# EasyEDA Pro project RV1106_V1.epro, board PCB1
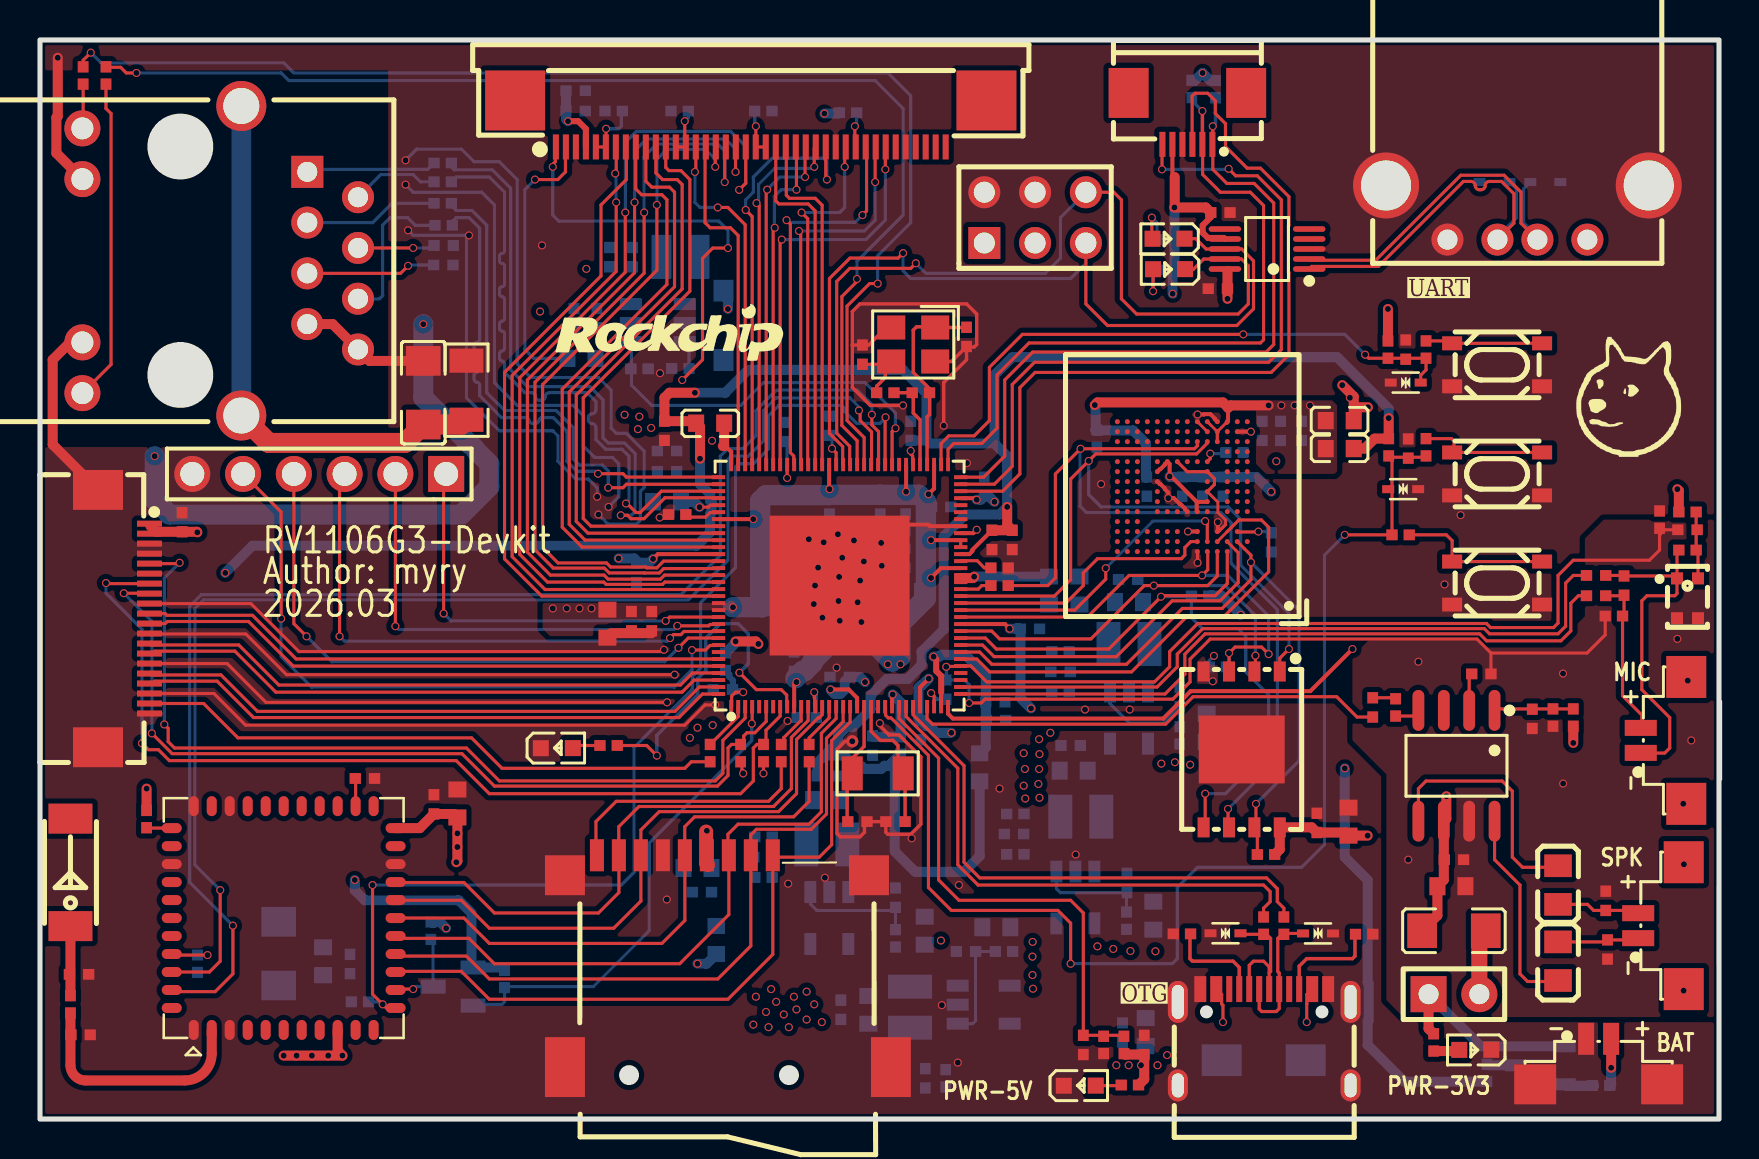
[diagram p13: board, top side]
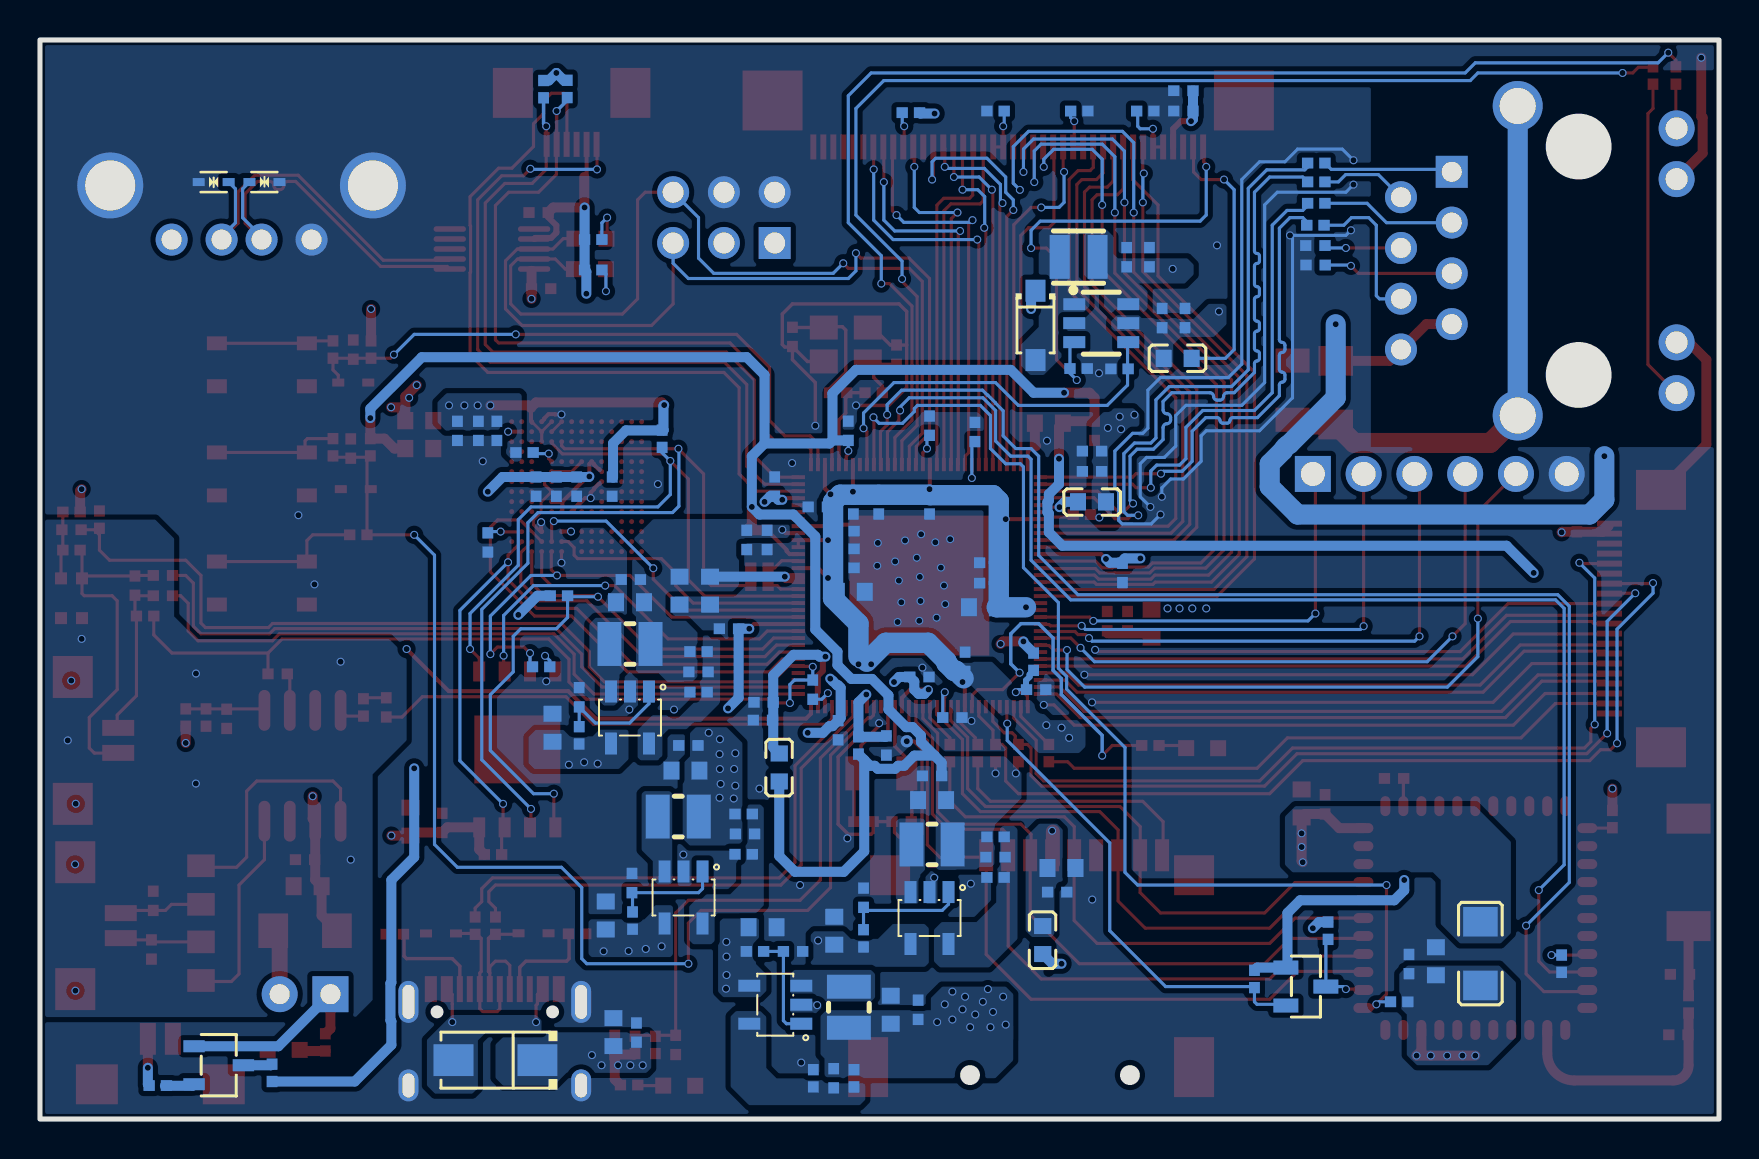
[diagram p14: board, bottom side, seen from below]

Outline 84 x 54 mm; copper layers: Top Layer, GND, PWR, Bottom Layer. Coordinates in mm from the lower left corner of the outline.
Outline path: rectangle 0,54 84,0
Stack: Top Layer 0.035mm Outer layer thickness 1oz / Dielectric1 0.2104mm 7628 RC49% 8.6mil / GND 0.0152mm Inner layer thickness / Dielectric2 1.065mm 1.1mm H/HOZ Copper / PWR 0.0152mm Inner layer thickness / Dielectric3 0.2104mm 7628 RC49% 8.6mil / Bottom Layer 0.035mm Outer layer thickness 1oz

## Design rules (mm)
net UART_DP: DP10
net UART_DN: DP10
net $8N37: DP1
net $8N38: DP1
net MIPI_RX_D1N: DP7
net MIPI_RX_D1P: DP7
net MIPI_RX_CLK0N: DP8
net MIPI_RX_CLK0P: DP8
net MIPI_RX_D0N: DP9
net MIPI_RX_D0P: DP9
net ETH_RN: DP3
net ETH_RP: DP3
net ETH_TN: DP4
net ETH_TP: DP4
net USB_DN: DP2
net USB_DP: DP2
spacing copperThickness1oz (default): track to track 0.102, other pairs 0.152 to 0.3
spacing copperThickness2oz: track to track 0.203, other pairs 0.152 to 0.3
track width copperThickness1oz (default): min 0.127, default 0.5, max 2.54
track width copperThickness2oz: min 0.203, default 0.254, max 2.54
differential pair differentialPair (default): width min 0.127, default 0.158, max 2.54; gap min 0.152, default 0.2
net 0V9 uses copperRegion
net $1N52 uses copperRegion
net +5V uses copperRegion
net GND uses copperRegion
net $1N43 uses copperRegion
net 3V3 uses copperRegion
net $1N38 uses copperRegion
net 1V8 uses copperRegion
net $1N4 uses copperRegion
net AGND uses copperRegion
net VCC_FLASH uses copperRegion
net $10N1 uses copperRegion
net $11N32 uses copperRegion
net $13N14 uses copperRegion
net $8N5 uses copperRegion
net $11N45 uses copperRegion
net $1N53 uses copperRegion
net $1N44 uses copperRegion
net $1N39 uses copperRegion
net $1N5 uses copperRegion
net EMMC_D6 uses copperRegion

## Placement (name value [footprint] x y rotation side)
C1  22pF DNP  [C0402]  48.73 14.27 0 bottom
C2  10uF  [C0603]  55.63 10.18 90 bottom
C3  22uF  [C0603]  51.71 17.51 0 bottom
C4  100nF  [C0402]  51.56 18.69 180 bottom
C6  22pF DNP  [C0402]  51.05 22.38 0 bottom
C7  10uF  [C0603]  58.29 19.58 90 bottom
C8  22uF  [C0603]  54.48 25.93 0 bottom
C9  100nF  [C0402]  54.44 27 180 bottom
C10  100nF  [C0402]  57.02 21.11 270 bottom
C11  22pF DNP  [C0402]  44.29 2.04 90 bottom
C12  10uF  [C0603]  47.85 9.53 180 bottom
C13  22uF  [C0603]  41.37 5.47 90 bottom
C14  22pF DNP  [C0402]  36.2 13.11 0 bottom
C15  100nF  [C0402]  40.07 5.47 270 bottom
C16  10uF  [C0603]  44.2 9.42 90 bottom
C17  22uF  [C0603]  39.37 16.03 0 bottom
C18  100nF  [C0402]  39.37 17.17 180 bottom
C19  100nF  [C0402]  46.33 8.39 0 bottom
C20  100nF  [C0402]  42.8 11.07 270 bottom
C21  1uF  [C0402]  77.85 27.2 180 top
C22  1uF  [C0402]  77.85 26.19 180 top
C23  4.7uF  [C0402]  47.8 20.85 0 bottom
C24  100nF  [C0402]  47.83 19.96 0 bottom
C25  4.7uF  [C0402]  45.34 21.49 270 bottom
C26  1uF  [C0402]  31.37 33.43 0 bottom
C27  100nF  [C0402]  31.37 32.41 0 bottom
C28  100nF  [C0402]  41.66 18.69 270 bottom
C29  100nF  [C0402]  44.07 19.46 270 bottom
C30  10uF  [C0603]  36.83 25.68 0 bottom
C31  10uF  [C0603]  43.43 26.31 180 bottom
C32  1uF  [C0402]  36.51 26.82 0 bottom
C33  1uF  [C0402]  43.75 27.58 180 bottom
C34  100nF  [C0402]  43.75 29.42 180 bottom
C35  100nF  [C0402]  43.75 28.54 180 bottom
C36  100nF  [C0402]  36.51 27.84 0 bottom
C37  100nF  [C0402]  39.5 30.76 270 bottom
C38  100nF  [C0402]  37.72 22.88 90 bottom
C39  100nF  [C0402]  42.04 30.76 270 bottom
C40  100nF  [C0402]  43.31 30.76 270 bottom
C41  10uF  [C0603]  28.32 24.79 270 top
C42  1uF  [C0402]  29.59 24.92 270 top
C43  100nF  [C0402]  30.61 24.92 270 top
C44  10uF  [C0603]  52.07 26.44 270 bottom
C45  10uF  [C0603]  50.55 26.44 270 bottom
C46  1uF  [C0402]  47.62 28.98 270 bottom
C47  100nF  [C0402]  48.64 28.98 270 bottom
C48  1uF  [C0402]  47.62 28.98 270 top
C49  100nF  [C0402]  48.64 28.98 270 top
C50  22pF  [C0402]  41.15 38.25 90 top
C51  100nF  [C0402]  43.56 34.44 90 bottom
C52  22pF  [C0402]  46.36 39.14 270 top
C53  NC  [C0402]  40.89 14.88 0 top
C54  100nF  [C0402]  31.24 34.44 270 top
C55  NC  [C0402]  42.8 14.88 180 top
C56  1uF  [C0402]  40.01 22.12 180 bottom
C57  100nF  [C0402]  45.08 30.63 0 bottom
C58  100nF  [C0402]  47.24 31.65 90 bottom
C59  100nF  [C0402]  39.5 34.7 90 bottom
C60  100nF  [C0402]  49.53 24.54 0 bottom
C61  100nF  [C0402]  38.35 20.09 180 bottom
C62  100nF  [C0402]  29.84 27.33 270 bottom
C63  100nF  [C0402]  37.23 34.38 90 bottom
C64  100nF  [C0402]  34.16 21.49 180 bottom
C65  100nF  [C0402]  82.42 29.49 180 top
C66  10pF DNP  [C0402]  79.25 26.69 270 top
C67  100nF  [C0402]  74.66 20.03 270 top
C68  1nF  [C0402]  78.42 8.48 90 top
C69  1uF  [C0402]  72.11 22.28 180 top
C70  47nF  [C0402]  66.67 20.6 90 top
C71  100nF  [C0402]  70.74 12.98 180 top
C73  1nF  [C0402]  78.33 10.92 270 top
C74  10nF  [C0402]  20.18 42.74 0 bottom
C75  100nF  [C0402]  68.33 38.51 90 top
C76  10nF  [C0402]  20.19 43.71 0 bottom
C77  100nF  [C0402]  68.45 33.55 90 top
C78  100nF  [C0402]  58.93 41.55 180 top
C79  4.7uF  [C0402]  59.05 45.36 0 top
C80  2.2uF  [C0402]  55.24 3.71 90 top
C81  22uF  [C0603]  55.24 4.35 90 bottom
C82  100nF  [C0402]  54.16 4.33 90 bottom
C83  100nF  [C0402]  52.2 3.71 270 top
C84  100nF  [C0402]  63.88 14.82 90 top
C85  10uF  [C0603]  65.53 14.88 90 top
C86  4.7uF  [C0402]  63.12 34.44 270 bottom
C87  100nF  [C0402]  62.07 34.44 270 bottom
C88  100nF  [C0402]  61.14 34.44 270 bottom
C89  100nF  [C0402]  55.37 31.65 270 bottom
C91  4.7uF  [C0402]  59.18 31.65 270 bottom
C92  100nF  [C0402]  58.17 31.65 270 bottom
C93  100nF  [C0402]  57.15 31.65 270 bottom
C94  100nF  [C0402]  33.11 11.35 180 bottom
C95  10uF  [C0603]  32.89 12.49 180 bottom
C96  4.7uF  [C0402]  29.64 43.13 90 bottom
C97  100nF  [C0402]  28.49 43.13 90 bottom
C98  1uF  [C0402]  27.86 40.08 90 bottom
C99  100nF  [C0402]  26.71 40.08 90 bottom
C100  4.7uF  [C0402]  26.8 50.44 0 bottom
C101  100nF  [C0402]  26.8 51.46 0 bottom
C102  100nF  [C0402]  7.11 29.87 90 top
C103  NC  [C0402]  2.03 4.22 0 top
C104  NC  [C0402]  1.95 7.24 0 top
C105  10uF  [C0603]  14.1 7.9 90 bottom
C106  100nF  [C0402]  15.51 7.75 90 bottom
C107  10uF  [C0603]  20.95 15.79 90 top
C108  100nF  [C0402]  19.71 15.75 90 top
C109  100nF DNP  [C0402]  16.26 17.04 0 top
C110  1uF  [C0402]  61.59 28.85 90 bottom
C111  22uF  [C0603]  70.61 11.58 0 top
C112  NC  [C0402]  54.38 11.81 270 bottom
C113  1nF  [C1206]  19.18 36.35 90 top
CARD1  TF-01A  [TF-SMD_TF-02]  34.42 7.9 0 top
D1  BAT54C  [SOT-23-3_L2.9-W1.6-P1.90-LS2.8-BR]  75.06 2.69 0 bottom
D2  LESD5Z5.0CT1G  [SOD-523_L1.2-W0.8-LS1.6-BI]  68.33 36.85 0 top
D3  LESD5Z5.0CT1G  [SOD-523_L1.2-W0.8-LS1.6-BI]  68.2 31.52 180 top
D4  LESD5Z5.0CT1G  [SOD-523_L1.2-W0.8-LS1.6-BI]  75.31 46.89 180 bottom
D5  LESD5Z5.0CT1G  [SOD-523_L1.2-W0.8-LS1.6-BI]  72.77 46.89 0 bottom
D6  SS34  [SMA_L4.3-W2.5-LS5.0-RD]  61.21 2.95 0 bottom
D7  LESD5Z5.0CT1G  [SOD-523_L1.2-W0.8-LS1.6-BI]  63.94 9.29 180 top
D8  LESD5Z5.0CT1G  [SOD-523_L1.2-W0.8-LS1.6-BI]  59.31 9.3 0 top
D16  B5819W  [SOD-123F_L2.7-W1.6-LS3.8-RD-1]  34.2 39.72 270 bottom
FPC1  0.5K-AS-40PWBG  [FPC-SMD_40P-P0.50_0.5K-AS-40PWB]  35.56 49.81 180 top
FPC2  FPC-05F-6PH20  [FPC-SMD_6P-P0.50_XUNPU_FPC-05F-6PH20]  57.4 50.06 180 top
FPC3  FPC-05F-20PH20  [FPC-SMD_20P-P0.50_XUNPU_FPC-05F-20PH20]  4.19 25.04 270 top
H1  -  [HDR-TH_2P-P2.54-V-M-1]  70.74 6.25 0 top
H3  -  [HDR-TH_6P-P2.54-V-M-1]  13.97 32.28 180 top
H4  -  [HDR-TH_6P-P2.54-V-R2-C3-S2.54_A2541WV-2X3P]  49.78 45.11 0 top
J1  HR911105A  [RJ45-TH_HR911105A]  9.02 42.95 270 top
L1  2.2uH  [IND-SMD_L2.5-W2.0-1]  52.07 15.14 0 bottom
L2  120R@100MHZ  [L0603]  47.02 17.59 90 bottom
L3  2.2uH  [IND-SMD_L2.5-W2.0-1]  54.48 23.77 0 bottom
L4  2.2uH  [IND-SMD_L2.5-W2.0-1]  43.53 5.59 90 bottom
L5  2.2uH  [IND-SMD_L2.5-W2.0-1]  39.37 13.74 0 bottom
L6  120R@100MHZ  [L0603]  31.37 30.89 0 bottom
L7  120R@100MHZ  [L0603]  33.53 34.82 180 top
L8  120R  [L0603]  65.02 34.95 0 top
L9  120R  [L0603]  65.02 33.55 0 top
L10  600R  [L1206]  70.74 9.42 180 top
L11  1K 0.5A  [L0805]  75.95 7.9 90 top
L12  1K 0.5A  [L0805]  75.95 11.71 270 top
L13  120R  [L0603]  33.83 8.96 90 bottom
L14  120R @ 100MHZ  [L0603]  27.08 38.06 180 bottom
L15  22uH  [IND-SMD_L2.5-W2.0_SWPA252012S]  32.04 43.14 0 bottom
L16  AN2051-245  [ANT2051]  1.52 12.34 90 top
L17  600R  [L1206]  11.94 8.28 270 bottom
LED1  -  [LED_0603]  71.76 3.45 180 top
LED2  -  [LED_0603]  25.91 18.57 0 top
LED3  -  [LED_0603]  56.44 42.52 180 top
LED4  -  [LED_0603]  56.41 44.05 180 top
LED5  -  [LED_0603]  52.07 1.68 0 top
MIC1  ZTS6216  [MIC-SMD_4P-L2.8-W1.9-P1.84-TL]  82.42 26.06 0 top
Q1  2SK3018  [SOT-23-3_L2.9-W1.3-P1.90-LS2.4-BR]  20.67 6.63 0 bottom
R1  10kΩ  [R0402_3]  54.36 9.93 90 bottom
R2  100kΩ  [R0402_3]  48.8 15.26 180 bottom
R3  200kΩ  [R0402_3]  48.8 13.25 0 bottom
R4  1Ω  [R0402_3]  43.05 18.69 90 bottom
R5  100kΩ  [R0402_3]  57.02 19.2 90 bottom
R6  240kΩ  [R0402_3]  51.05 23.39 180 bottom
R7  1Ω  [R0402_3]  34.29 22.88 270 bottom
R8  191kΩ  [R0402_3]  51.05 21.36 0 bottom
R9  200kΩ  [R0402_3]  48.23 8.39 0 bottom
R10  680kΩ  [R0402_3]  43.28 2.04 90 bottom
R11  2kΩ  [R0402_3]  69.72 3.83 90 top
R12  100kΩ  [R0402_3]  42.8 9.04 270 bottom
R13  200kΩ  [R0402_3]  36.2 14.12 0 bottom
R14  150kΩ  [R0402_3]  45.31 2.04 270 bottom
R15  100kΩ  [R0402_3]  36.2 12.09 180 bottom
R16  1kΩ  [R0402_3]  78.11 1.68 0 bottom
R17  100Ω  [R0402_3]  72.39 2.31 90 bottom
R18  0Ω  [R0402_3]  81.03 30 90 top
R19  240Ω  [R0402_3]  48.01 27.58 0 top
R20  6.04kΩ  [R0402_3]  31.88 30.25 180 top
R21  22Ω  [R0402_3]  42.29 36.35 0 top
R22  1MΩ  [R0402_3]  44.07 36.35 0 top
R23  22Ω  [R0402_3]  48.01 26.69 0 top
R24  100Ω  [R0402_3]  37.08 18.31 270 top
R25  22Ω  [R0402_3]  38.48 18.31 270 top
R26  22Ω  [R0402_3]  33.53 18.31 270 top
R27  1kΩ  [R0402_3]  28.45 18.69 180 top
R28  100Ω  [R0402_3]  82.42 30.38 0 top
R29  1kΩ  [R0402_3]  82.42 28.47 0 top
R30  1kΩ  [R0402_3]  78.74 25.17 0 top
R31  20kΩ  [R0402_3]  76.71 20.09 270 top
R32  10kΩ  [R0402_3]  75.69 20.09 90 top
R33  30kΩ  [R0402_3]  67.82 20.6 90 top
R34  10kΩ  [R0402_3]  67.44 38.51 270 top
R35  100Ω  [R0402_3]  69.34 38.51 90 top
R36  0Ω  [R0402_3]  20.19 44.73 0 bottom
R37  0Ω  [R0402_3]  20.15 45.83 0 bottom
R38  0Ω  [R0402_3]  20.15 46.9 0 bottom
R39  0Ω  [R0402_3]  20.15 47.84 0 bottom
R40  1kΩ  [R0402_3]  2.16 52.22 90 top
R41  1kΩ  [R0402_3]  3.3 52.22 90 top
R42  10kΩ  [R0402_3]  67.47 33.62 270 top
R43  5.1kΩ  [R0402_3]  68.07 29.23 0 top
R44  100Ω  [R0402_3]  69.34 33.62 90 top
R45  4.7kΩ  [R0402_3]  56.32 42.49 180 bottom
R46  4.7kΩ  [R0402_3]  56.32 44.01 180 bottom
R47  10kΩ  [R0402_3]  54.23 3.71 270 top
R48  2.2Ω  [R0402_3]  61.21 9.68 90 top
R49  2.2Ω  [R0402_3]  62.23 9.68 270 top
R50  15kΩ  [R0402_3]  53.21 3.71 90 top
R51  5.1kΩ  [R0402_3]  57.13 9.27 0 top
R52  2kΩ  [R0402_3]  54.53 1.7 0 top
R53  5.1kΩ  [R0402_3]  66.25 9.25 180 top
R54  10kΩ  [R0402_3]  58.93 22.63 0 bottom
R55  10kΩ  [R0402_3]  61.34 13.24 180 top
R56  4.7kΩ  [R0402_3]  59.76 33.36 0 bottom
R57  10kΩ  [R0402_3]  58.04 26.19 0 bottom
R58  10kΩ  [R0402_3]  52.87 34.04 90 bottom
R59  0Ω  [R0402_3]  28.7 50.44 0 bottom
R60  0Ω  [R0402_3]  32 50.44 0 bottom
R61  0Ω  [R0402_3]  36.2 50.44 180 bottom
R62  100kΩ  [R0402_3]  29.99 37.54 0 bottom
R63  5.1Ω  [R0402_3]  32.04 37.56 180 bottom
R64  10kΩ  [R0402_3]  40.43 50.36 0 bottom
R65  4.7kΩ  [R0402_3]  35.05 18.31 270 top
R66  4.7kΩ  [R0402_3]  36.2 18.31 270 top
R67  0Ω  [R0402_3]  1.52 5.74 270 top
R68  47kΩ  [R0402_3]  16 5.87 180 bottom
R69  10kΩ DNP  [R0402_3]  7.87 7.77 90 bottom
R70  47kΩ  [R0402_3]  5.33 15.01 270 top
R71  10kΩ  [R0402_3]  23.24 7.01 270 bottom
R72  10kΩ  [R0402_3]  19.56 9.42 270 bottom
R73  10kΩ  [R0402_3]  57.62 51.55 270 bottom
R74  10kΩ  [R0402_3]  58.81 51.54 270 bottom
R75  1M  [R1206]  21.34 36.47 90 top
SW1  TS3425BA  [SW-SMD_4P-L4.2-W3.2-P2.15-LS4.6-1]  72.9 37.74 0 top
SW2  TS3425BA  [SW-SMD_4P-L4.2-W3.2-P2.15-LS4.6-1]  72.9 32.28 0 top
SW3  TS3425BA  [SW-SMD_4P-L4.2-W3.2-P2.15-LS4.6-1]  72.9 26.82 0 top
U1  -  [QFN-128_L12.3-W12.3-P0.35-TL-EP7.0-1]  40.01 26.69 90 top
U2  MT3520B  [SOT-23-5_L3.0-W1.7-P0.95-LS2.8-BR]  51.8 11.09 90 bottom
U3  MT3520B  [SOT-23-5_L3.0-W1.7-P0.95-LS2.8-BR]  54.48 20.09 90 bottom
U4  MT3520B  [SOT-23-5_L3.0-W1.7-P0.95-LS2.8-BR]  47.21 5.72 180 bottom
U5  MT3520B  [SOT-23-5_L3.0-W1.7-P0.95-LS2.8-BR]  39.5 10.06 90 bottom
U6  ZX-MX1.25-2PLT  [CONN-SMD_2P-P1.25-MX1.25-2P-LT]  77.98 2.56 0 top
U7  ZX-MX1.25-2PLT  [CONN-SMD_2P-P1.25-MX1.25-2P-LT]  81.53 18.95 90 top
U8  NS4158  [SOIC-8_L4.9-W3.9-P1.27-LS6.0-BL]  70.87 17.68 180 top
U9  ZX-MX1.25-2PLT  [CONN-SMD_2P-P1.25-MX1.25-2P-LT]  81.41 9.68 90 top
U10  CH340E  [MSOP-10_L3.0-W3.0-P0.50-LS5.0-BL]  61.39 43.54 90 top
U11  W25N02KVZEIR  [WSON-8_L8.0-W6.0-P1.27-TL-EP-1]  60.12 18.5 270 top
U12  -  [FBGA-153_L13.0-W11.5-P0.50_KLMAG1JETD-B041]  57.15 31.65 180 top
U13  MT9284-28J  [SOT-23-6_L2.9-W1.6-P0.95-LS2.8-BR]  30.91 39.83 0 bottom
U14  -  [RTL8723DS]  12.19 10.06 90 top
USB2  HC-TYPE-C-16P-01A  [USB-C-SMD_HC-TYPE-C-16P-01A]  61.25 4.09 0 top
USB3  USB-231-ARY  [USB-A-TH_USB-231-ARY]  73.91 45.36 180 top
X1  24MHz  [CRYSTAL-SMD_4P-L3.2-W2.5-BL]  43.69 38.76 180 top
X2  32.768kHz  [OSC-SMD_L3.2-W1.5]  41.91 17.3 180 top

## Footprints (pads in the part's own frame, mm; a bottom-side part is the same pattern mirrored in y, then rotated)
ANT2051
  rect 1.5x2.2 smd: 1(-2.69,0) 2(2.69,0)
C0402
  rect 0.566x0.54 smd: 1(-0.481,0) 2(0.481,0)
C0603
  rect 0.8x0.9 smd: 1(-0.701,0.068) 2(0.699,0.068)
C1206
  rect 1.485x1.728 smd: 1(-1.593,0) 2(1.593,0)
CONN-SMD_2P-P1.25-MX1.25-2P-LT
  rect 0.8x1.6 smd: 1(-0.625,1.45) 2(0.625,1.45)
  rect 2.1x2 smd: 3(-3.175,-0.827) 4(3.175,-0.827)
CRYSTAL-SMD_4P-L3.2-W2.5-BL
  rect 1.4x1.2 smd: 1(-1.1,-0.85) 2(1.1,-0.85) 3(1.1,0.85) 4(-1.1,0.85)
FBGA-153_L13.0-W11.5-P0.50_KLMAG1JETD-B041
  round 0.25 smd: A3(-2.25,3.25) A4(-1.75,3.25) A5(-1.25,3.25) A6(-0.75,3.25) A8(0.25,3.25) A9(0.75,3.25) A10(1.25,3.25) A11(1.75,3.25) A12(2.25,3.25) A13(2.75,3.25) A14(3.25,3.25) B1(-3.25,2.75) B2(-2.75,2.75) B3(-2.25,2.75) B4(-1.75,2.75) B5(-1.25,2.75) B6(-0.75,2.75) B8(0.25,2.75) B9(0.75,2.75) B10(1.25,2.75) B11(1.75,2.75) B12(2.25,2.75) B13(2.75,2.75) B14(3.25,2.75) C2(-2.75,2.25) C4(-1.75,2.25) C6(-0.75,2.25) C8(0.25,2.25) C9(0.75,2.25) C10(1.25,2.25) C11(1.75,2.25) C12(2.25,2.25) C13(2.75,2.25) C14(3.25,2.25) D12(2.25,1.75) D13(2.75,1.75) D14(3.25,1.75) E1(-3.25,1.25) E2(-2.75,1.25) E3(-2.25,1.25) E5(-1.25,1.25) E6(-0.75,1.25) E7(-0.25,1.25) E8(0.25,1.25) E9(0.75,1.25) E10(1.25,1.25) E12(2.25,1.25) E13(2.75,1.25) E14(3.25,1.25) F1(-3.25,0.75) F2(-2.75,0.75) F3(-2.25,0.75) F5(-1.25,0.75) F10(1.25,0.75) F12(2.25,0.75) F13(2.75,0.75) F14(3.25,0.75) G1(-3.25,0.25) G2(-2.75,0.25) G3(-2.25,0.25) G5(-1.25,0.25) G10(1.25,0.25) G12(2.25,0.25) G13(2.75,0.25) G14(3.25,0.25) H1(-3.25,-0.25) H2(-2.75,-0.25) H3(-2.25,-0.25) H5(-1.25,-0.25) H10(1.25,-0.25) H12(2.25,-0.25) H13(2.75,-0.25) H14(3.25,-0.25) J1(-3.25,-0.75) J2(-2.75,-0.75) J3(-2.25,-0.75) J5(-1.25,-0.75) J10(1.25,-0.75) J12(2.25,-0.75) J13(2.75,-0.75) J14(3.25,-0.75) K1(-3.25,-1.25) K2(-2.75,-1.25) K3(-2.25,-1.25) K5(-1.25,-1.25) K6(-0.75,-1.25) K7(-0.25,-1.25) K8(0.25,-1.25) K9(0.75,-1.25) K10(1.25,-1.25) K12(2.25,-1.25) K13(2.75,-1.25) K14(3.25,-1.25) L1(-3.25,-1.75) L2(-2.75,-1.75) L3(-2.25,-1.75) M1(-3.25,-2.25) M2(-2.75,-2.25) M3(-2.25,-2.25) M4(-1.75,-2.25) M5(-1.25,-2.25) M6(-0.75,-2.25) M7(-0.25,-2.25) M8(0.25,-2.25) M9(0.75,-2.25) M10(1.25,-2.25) M11(1.75,-2.25) M12(2.25,-2.25) M13(2.75,-2.25) M14(3.25,-2.25) N2(-2.75,-2.75) N3(-2.25,-2.75) N4(-1.75,-2.75) N5(-1.25,-2.75) N6(-0.75,-2.75) N7(-0.25,-2.75) N8(0.25,-2.75) N9(0.75,-2.75) N10(1.25,-2.75) N11(1.75,-2.75) N12(2.25,-2.75) N13(2.75,-2.75) N14(3.25,-2.75) P1(-3.25,-3.25) P2(-2.75,-3.25) P3(-2.25,-3.25) P4(-1.75,-3.25) P5(-1.25,-3.25) P6(-0.75,-3.25) P7(-0.25,-3.25) P8(0.25,-3.25) P9(0.75,-3.25) P10(1.25,-3.25) P11(1.75,-3.25) P12(2.25,-3.25) P13(2.75,-3.25) P14(3.25,-3.25)
FPC-SMD_6P-P0.50_XUNPU_FPC-05F-6PH20
  rect 0.3x1.25 smd: 1(-1.25,1.288) 2(-0.75,1.288) 3(-0.25,1.288) 4(0.25,1.288) 5(0.75,1.288) 6(1.25,1.288)
  rect 2x2.5 smd: 7(2.94,-1.288) 8(-2.94,-1.288)
FPC-SMD_20P-P0.50_XUNPU_FPC-05F-20PH20
  rect 0.3x1.25 smd: 1(-4.75,1.288) 2(-4.25,1.288) 3(-3.75,1.288) 4(-3.25,1.288) 5(-2.75,1.288) 6(-2.25,1.288) 7(-1.75,1.288) 8(-1.25,1.288) 9(-0.75,1.288) 10(-0.25,1.288) 11(0.25,1.288) 12(0.75,1.288) 13(1.25,1.288) 14(1.75,1.288) 15(2.25,1.288) 16(2.75,1.288) 17(3.25,1.288) 18(3.75,1.288) 19(4.25,1.288) 20(4.75,1.288)
  rect 2x2.5 smd: 21(6.44,-1.288) 22(-6.44,-1.288)
FPC-SMD_40P-P0.50_0.5K-AS-40PWB
  rect 0.3x1.25 smd: 1(9.75,1.163) 2(9.25,1.163) 3(8.75,1.163) 4(8.25,1.163) 5(7.75,1.163) 6(7.25,1.163) 7(6.75,1.163) 8(6.25,1.163) 9(5.75,1.163) 10(5.25,1.163) 11(4.75,1.163) 12(4.25,1.163) 13(3.75,1.163) 14(3.25,1.163) 15(2.75,1.163) 16(2.25,1.163) 17(1.75,1.163) 18(1.25,1.163) 19(0.75,1.163) 20(0.25,1.163) 21(-0.25,1.163) 22(-0.75,1.163) 23(-1.25,1.163) 24(-1.75,1.163) 25(-2.25,1.163) 26(-2.75,1.163) 27(-3.25,1.163) 28(-3.75,1.163) 29(-4.25,1.163) 30(-4.75,1.163) 31(-5.25,1.163) 32(-5.75,1.163) 33(-6.25,1.163) 34(-6.75,1.163) 35(-7.25,1.163) 36(-7.75,1.163) 37(-8.25,1.163) 38(-8.75,1.163) 39(-9.25,1.163) 40(-9.75,1.163)
  rect 3x3 smd: 41(-11.79,-1.163) 42(11.79,-1.163)
HDR-TH_2P-P2.54-V-M-1
  rect 1.8x1.8 hole 1: 1(-1.27,0)
  round 1.8 hole 1: 2(1.27,0)
HDR-TH_6P-P2.54-V-M-1
  rect 1.8x1.8 hole 1.2: 1(-6.35,0)
  round 1.8 hole 1.2: 2(-3.81,0) 3(-1.27,0) 4(1.27,0) 5(3.81,0) 6(6.35,0)
HDR-TH_6P-P2.54-V-R2-C3-S2.54_A2541WV-2X3P
  rect 1.6x1.6 hole 1.05: 1(-2.54,-1.27)
  round 1.6 hole 1.05: 2(-2.54,1.27) 3(0,-1.27) 4(0,1.27) 5(2.54,-1.27) 6(2.54,1.27)
IND-SMD_L2.5-W2.0-1
  rect 1.2x2.2 smd: 1(1.028,0) 2(-1.028,0)
IND-SMD_L2.5-W2.0_SWPA252012S
  rect 1x2.2 smd: 1(-0.951,0) 2(0.951,0)
L0603
  rect 0.8x0.864 smd: 1(-0.7,0) 2(0.7,0)
L0805
  rect 1.133x1.377 smd: 1(-0.966,0) 2(0.966,0)
L1206
  rect 1.485x1.728 smd: 1(-1.593,0) 2(1.593,0)
LED_0603
  rect 0.8x0.8 smd: 1(-0.851,-0.01) 2(0.75,-0.005)
MIC-SMD_4P-L2.8-W1.9-P1.84-TL
  rect 0.6x0.6 smd: 1(-0.525,0.995) 2(-0.525,-0.995) 3(0.525,-0.995) 4(0.525,0.995)
MSOP-10_L3.0-W3.0-P0.50-LS5.0-BL
  oval 0.28x1.62 smd: 1(-1,-2.11) 2(-0.5,-2.11) 3(0,-2.11) 4(0.5,-2.11) 5(1,-2.11) 6(1,2.11) 7(0.5,2.11) 8(0,2.11) 9(-0.5,2.11) 10(-1,2.11)
OSC-SMD_L3.2-W1.5
  rect 1.05x1.7 smd: 1(-1.275,0) 2(1.275,0)
QFN-128_L12.3-W12.3-P0.35-TL-EP7.0-1
  rect 0.665x0.196 smd: 1(-6.058,5.425) 2(-6.058,5.075) 3(-6.058,4.725) 4(-6.058,4.375) 5(-6.058,4.025) 6(-6.058,3.675) 7(-6.058,3.325) 8(-6.058,2.975) 9(-6.058,2.625) 10(-6.058,2.275) 11(-6.058,1.925) 12(-6.058,1.575) 13(-6.058,1.225) 14(-6.058,0.875) 15(-6.058,0.525) 16(-6.058,0.175) 17(-6.058,-0.175) 18(-6.058,-0.525) 19(-6.058,-0.875) 20(-6.058,-1.225) 21(-6.058,-1.575) 22(-6.058,-1.925) 23(-6.058,-2.275) 24(-6.058,-2.625) 25(-6.058,-2.975) 26(-6.058,-3.325) 27(-6.058,-3.675) 28(-6.058,-4.025) 29(-6.058,-4.375) 30(-6.058,-4.725) 31(-6.058,-5.075) 32(-6.058,-5.425) 65(6.058,-5.425) 66(6.058,-5.075) 67(6.058,-4.725) 68(6.058,-4.375) 69(6.058,-4.025) 70(6.058,-3.675) 71(6.058,-3.325) 72(6.058,-2.975) 73(6.058,-2.625) 74(6.058,-2.275) 75(6.058,-1.925) 76(6.058,-1.575) 77(6.058,-1.225) 78(6.058,-0.875) 79(6.058,-0.525) 80(6.058,-0.175) 81(6.058,0.175) 82(6.058,0.525) 83(6.058,0.875) 84(6.058,1.225) 85(6.058,1.575) 86(6.058,1.925) 87(6.058,2.275) 88(6.058,2.625) 89(6.058,2.975) 90(6.058,3.325) 91(6.058,3.675) 92(6.058,4.025) 93(6.058,4.375) 94(6.058,4.725) 95(6.058,5.075) 96(6.058,5.425)
  rect 0.196x0.665 smd: 33(-5.425,-6.058) 34(-5.075,-6.058) 35(-4.725,-6.058) 36(-4.375,-6.058) 37(-4.025,-6.058) 38(-3.675,-6.058) 39(-3.325,-6.058) 40(-2.975,-6.058) 41(-2.625,-6.058) 42(-2.275,-6.058) 43(-1.925,-6.058) 44(-1.575,-6.058) 45(-1.225,-6.058) 46(-0.875,-6.058) 47(-0.525,-6.058) 48(-0.175,-6.058) 49(0.175,-6.058) 50(0.525,-6.058) 51(0.875,-6.058) 52(1.225,-6.058) 53(1.575,-6.058) 54(1.925,-6.058) 55(2.275,-6.058) 56(2.625,-6.058) 57(2.975,-6.058) 58(3.325,-6.058) 59(3.675,-6.058) 60(4.025,-6.058) 61(4.375,-6.058) 62(4.725,-6.058) 63(5.075,-6.058) 64(5.425,-6.058) 97(5.425,6.058) 98(5.075,6.058) 99(4.725,6.058) 100(4.375,6.058) 101(4.025,6.058) 102(3.675,6.058) 103(3.325,6.058) 104(2.975,6.058) 105(2.625,6.058) 106(2.275,6.058) 107(1.925,6.058) 108(1.575,6.058) 109(1.225,6.058) 110(0.875,6.058) 111(0.525,6.058) 112(0.175,6.058) 113(-0.175,6.058) 114(-0.525,6.058) 115(-0.875,6.058) 116(-1.225,6.058) 117(-1.575,6.058) 118(-1.925,6.058) 119(-2.275,6.058) 120(-2.625,6.058) 121(-2.975,6.058) 122(-3.325,6.058) 123(-3.675,6.058) 124(-4.025,6.058) 125(-4.375,6.058) 126(-4.725,6.058) 127(-5.075,6.058) 128(-5.425,6.058)
  rect 7x7 smd: 129(0,0)
R0402_3
  rect 0.566x0.54 smd: 1(-0.433,0) 2(0.433,0)
R1206
  rect 1.208x1.701 smd: 1(-1.479,0) 2(1.479,0)
RJ45-TH_HR911105A
  rect 1.6x1.6 hole 1: 1(-4.45,4.355)
  round 1.6 hole 1: 2(-3.18,6.895) 3(-1.91,4.355) 4(-0.64,6.895) 5(0.63,4.355) 6(1.9,6.895) 7(3.17,4.355) 8(4.44,6.895)
  round 1.8 hole 1.1: 9(-6.625,-6.895) 10(-4.085,-6.895) 11(4.085,-6.895) 12(6.625,-6.895)
  round 2.5 hole 1.8: SH1(-7.745,1.055) SH2(7.745,1.055)
RTL8723DS
  oval 1x0.5 smd: 1(-5.6,4.5) 2(-5.6,3.6) 3(-5.6,2.7) 4(-5.6,1.8) 5(-5.6,0.9) 6(-5.6,0) 7(-5.6,-0.9) 8(-5.6,-1.8) 9(-5.6,-2.7) 10(-5.6,-3.6) 11(-5.6,-4.5) 23(5.6,-4.5) 24(5.6,-3.6) 25(5.6,-2.7) 26(5.6,-1.8) 27(5.6,-0.9) 28(5.6,0) 29(5.6,0.9) 30(5.6,1.8) 31(5.6,2.7) 32(5.6,3.6) 33(5.6,4.5)
  oval 0.5x1 smd: 12(-4.5,-5.6) 13(-3.6,-5.6) 14(-2.7,-5.6) 15(-1.8,-5.6) 16(-0.9,-5.6) 17(0,-5.6) 18(0.9,-5.6) 19(1.8,-5.6) 20(2.7,-5.6) 21(3.6,-5.6) 22(4.5,-5.6) 34(4.5,5.6) 35(3.6,5.6) 36(2.7,5.6) 37(1.8,5.6) 38(0.9,5.6) 39(0,5.6) 40(-0.9,5.6) 41(-1.8,5.6) 42(-2.7,5.6) 43(-3.6,5.6) 44(-4.5,5.6)
SMA_L4.3-W2.5-LS5.0-RD
  rect 2x1.593 smd: 1(-2.1,0) 2(2.1,0)
SOD-123F_L2.7-W1.6-LS3.8-RD-1
  rect 1.1x1 smd: 1(-1.735,0) 2(1.735,0)
SOD-523_L1.2-W0.8-LS1.6-BI
  rect 0.6x0.4 smd: 1(-0.75,0) 2(0.75,0)
SOIC-8_L4.9-W3.9-P1.27-LS6.0-BL
  oval 0.588x2.045 smd: 1(-1.905,-2.772) 2(-0.635,-2.772) 3(0.635,-2.772) 4(1.905,-2.772) 5(1.905,2.772) 6(0.635,2.772) 7(-0.635,2.772) 8(-1.905,2.772)
SOT-23-3_L2.9-W1.3-P1.90-LS2.4-BR
  rect 1.25x0.7 smd: 1(1,-0.95) 2(1,0.95) 3(-1,0)
SOT-23-3_L2.9-W1.6-P1.90-LS2.8-BR
  rect 1.07x0.6 smd: 1(1.235,-0.95) 2(1.235,0.95) 3(-1.235,0)
SOT-23-5_L3.0-W1.7-P0.95-LS2.8-BR
  rect 1.1x0.6 smd: 1(1.3,-0.95) 2(1.3,0) 3(1.3,0.95) 4(-1.3,0.95) 5(-1.3,-0.95)
SOT-23-6_L2.9-W1.6-P0.95-LS2.8-BR
  rect 1.1x0.6 smd: 1(1.35,-0.95) 2(1.35,0) 3(1.35,0.95) 4(-1.35,0.95) 5(-1.35,0) 6(-1.35,-0.95)
SW-SMD_4P-L4.2-W3.2-P2.15-LS4.6-1
  rect 1x0.7 smd: 1(-2.25,1.075) 2(2.25,1.075) 3(-2.25,-1.075) 4(2.25,-1.075)
TF-SMD_TF-02
  rect 0.7x1.6 smd: 1(2.245,5.3) 2(1.145,5.3) 3(0.046,5.3) 4(-1.054,5.3) 5(-2.155,5.3) 6(-3.255,5.3) 7(-4.354,5.3) 8(-5.454,5.3) 9(-6.554,5.3)
  rect 2x2 smd: 10(-8.154,4.3) 13(7.054,4.3)
  rect 2x3 smd: 11(-8.154,-5.3) 12(8.154,-5.3)
USB-A-TH_USB-231-ARY
  round 1.6 hole 1: 1(-3.5,1.355) 2(-1,1.355) 3(1,1.355) 4(3.5,1.355)
  round 3.3 hole 2.5: 5(-6.57,-1.355) 6(6.57,-1.355)
USB-C-SMD_HC-TYPE-C-16P-01A
  oval 1x2.1 hole 0.6x1.7: 1(-4.32,1.77) 2(4.32,1.77)
  oval 1x1.6 hole 0.6x1.2: 3(4.32,-2.41) 4(-4.32,-2.41)
  rect 0.6x1.3 smd: A1B12(-3.2,2.41) A4B9(-2.4,2.41) B1A12(3.2,2.41) B4A9(2.4,2.41)
  rect 0.3x1.3 smd: A5(-1.25,2.41) A6(-0.25,2.41) A7(0.25,2.41) A8(1.25,2.41) B5(1.75,2.41) B6(0.75,2.41) B7(-0.75,2.41) B8(-1.75,2.41)
WSON-8_L8.0-W6.0-P1.27-TL-EP-1
  rect 1x0.6 smd: 1(-3.9,1.905) 2(-3.9,0.635) 3(-3.9,-0.635) 4(-3.9,-1.905) 5(3.9,-1.905) 6(3.9,-0.635) 7(3.9,0.635) 8(3.9,1.905)
  rect 3.4x4.3 smd: 9(0,0)

## Nets
As in the schematic.

Pads without a net: FPC1 35 37 38 39 40 41 42; FPC2 7 8; L16 2; U1 35 36; U8 3; U10 4 5 6; U12 A8 A9 A10 A11 A12 A13 A14 B1 B8 B9 B10 B11 B12 B13 B14 C8 C9 C10 C11 C12 C13 C14 D12 D13 D14 E1 E2 E3 E5 E8 E9 E10 E12 E13 E14 F1 F2 F3 F10 F12 F13 F14 G1 G2 G3 G10 G12 G13 G14 H1 H2 H3 H5 H12 H13 H14 J1 J2 J3 J12 J13 J14 K1 K2 K3 K6 K7 K10 K12 K13 K14 L1 L2 L3 M1 M2 M3 M7 M8 M9 M10 M11 M12 M13 M14 N3 N6 N7 N8 N9 N10 N11 N12 N13 N14 P1 P2 P7 P8 P9 P10 P11 P12 P13 P14; U14 4 5 6 7 8 10 11 21 23 25 26 27 28 29 30 32 35 37 38 39 40 44; USB2 A8 B8; USB3 1

## Via types
v1: diameter 0.4, hole 0.3, Top Layer to Bottom Layer, 317 vias
v2: diameter 0.61, hole 0.305, Top Layer to Bottom Layer, 1 via

## Routing (per net, layer and track width the routed paths; a pad name or vN(x,y) marks a point on that pad's centre or on a via; arc(x,y) is an arc through that point)
0V9: length 49.8
  Top Layer w0.157: U1.54 U1.55
  Top Layer w0.2: U1.10 37.73,21.75 v1(37.85,21.87) ; U1.55 v1(44.58,28.97) ; U1.103 v1(35.69,30.02) ; U1.51 45.07,27.57 v1(44.58,27.08) ; U1.71 v1(43.33,31.39) ; v1(39.5,31.52) 39.48,31.54 U1.82 ; U1.67 44.73,31.55 v1(44.45,31.27)
  PWR w0.5: 38.73,18.82 38.73,20.55 38.68,20.6 ; v1(37.85,21.87) 37.85,20.95 38.2,20.6 38.68,20.6 ; 38.68,20.6 39.62,20.6 40.26,21.23 40.26,21.87 41.15,22.76 v1(42.42,22.76)
  PWR w1: v1(43.05,22.76) v1(42.42,22.76)
  Bottom Layer w1.016: 37.79,22.06 38.16,22.42 38.26,22.42 38.65,22.81 38.65,22.91 39.57,23.83 41.69,23.83 42.64,22.88 ; 43.05,23.14 43.05,24.79 44.32,26.06 44.32,30.89 43.97,31.24 C40.1 C39.1 C37.1 39.48,31.22 36.32,31.22 36.03,30.93 C36.1 C32.1 36.03,25.71 C30.1 v1(34.67,25.61)
  vias: v1(25.65,25.55) v1(26.35,25.55) v1(26.99,25.55) v1(27.59,25.55) v1(32.51,19.07) v1(32.89,19.58) v1(33.65,19.71) v1(49.21,18.31) v1(49.27,17.52) v1(49.21,16.68) v1(49.29,16.04) v1(49.98,19.01) v1(49.98,17.51) v1(49.95,16.77) v1(50,18.26) v1(50,16.08) v1(50.55,19.33)
1V8: length 174.2
  Top Layer w0.157: v1(43.56,33.44) 43.56,33.28 43.66,33.18 43.66,32.77 U1.70 ; v1(35.18,17.3) 35.12,17.36 35.12,17.82 R65.2 ; R66.2 v1(36.2,17.3)
  Top Layer w0.2: C48.1 46.65,28.48 46.65,28.42 46.5,28.27 U1.53
  Top Layer w0.5: v1(34.8,23.9) 35.81,23.9 v1(35.94,23.77) ; v1(33.02,33.04) 33.02,34.63 L7.2 32.73,34.92 C54.1 31.24,36.09 31.5,36.35 v1(32.77,36.35) ; 65.72,33.55 66.27,33.55 66.77,34.05 R42.1 v1(67.47,35.08) ; v1(48.39,30.63) 48.39,29.72 C49.1 C48.1
  PWR w0.5: v1(35.94,23.77) 35.27,24.44 35.27,25.86 35.05,26.08 35.05,32.28 34.29,33.04 v1(33.02,33.04) ; v1(9.27,27.33) 9.27,15.01 12.32,11.96 v1(15.75,11.96)
  Bottom Layer w0.157: C51.1 v1(43.56,33.44)
  Bottom Layer w0.5: 42.76,17.97 43.05,18.26 ; 42.76,17.97 42.47,17.68 42.24,17.68 42.09,17.53 41.22,17.53 41.07,17.68 40.77,17.68 40.26,18.19 39.24,18.19 ; 42.76,17.97 42.76,13.39 43.79,12.37 46.23,12.37 47.02,13.16 L2.1 ; 39.24,18.19 38.89,17.83 C18.2 ; 39.24,18.19 39.93,18.87 39.93,19.2 40.34,19.61 40.67,19.61 41.55,20.5 41.55,21.2 42.37,22.02 43.41,22.02 44.1,22.72 44.1,23.39 45.21,24.5 45.21,29.16 46.31,30.25 48.01,30.25 v1(48.39,30.63) 48.39,33.17 47.75,33.81 ; v1(15.75,11.96) 15.75,11.45 16.25,10.95 20.95,10.95 21.59,10.31 21.59,7.66 Q1.1 23.11,7.58 R71.1 ; v1(34.8,23.9) 34.8,23.83 R7.1 ; v1(33.02,33.04) 33.02,31.77 33.53,31.27 33.53,30.94 33.6,30.87 33.6,30.37 33.53,30.3 33.53,29.36 32.86,28.69 10.63,28.69 v1(9.27,27.33) ; v1(32.77,36.35) 34.29,36.35 35.43,37.49 43.18,37.49 44.35,36.32 44.35,33.96 ; C51.1 44.35,33.96 ; 44.35,33.96 44.51,33.81 47.75,33.81 ; 47.75,33.81 47.75,37.24 48.64,38.12 64.9,38.12 67.47,35.55 v1(67.47,35.08)
1V35: length 5.4
  Top Layer w0.2: U1.56 46.69,29.32 v1(46.86,29.49)
  Top Layer w0.5: v1(46.74,27.14) 46.66,27.07 45.97,27.07
  Bottom Layer w0.5: C45.1 v1(46.74,27.14)
3V3: length 198.8
  Top Layer w0.157: v1(39.62,33.55) 39.83,33.35 U1.81 ; U1.13 38.76,20.66 38.76,21.07 38.73,21.09 v1(38.73,21.36) ; U1.88 v1(37.38,32.08)
  Top Layer w0.2: 44.03,20.64 44.03,21.6 v1(44.46,22.04) ; U1.61 46.78,31.07 v1(46.86,30.99) ; U12.F5 58.39,30.89 57.87,30.89 ; 57.87,30.89 56.6,32.16 v1(56.52,32.16) 56.52,32.78 U12.K9 56.28,32.77 56.28,32.74 56.06,32.52 56.02,32.52 U12.J10 ; 57.87,30.89 57.87,30.43 U12.E6 ; U1.108 30.91,28.27 v1(30.67,28.03) ; 56.77,47.14 56.65,47.26 FPC2.5
  Top Layer w0.3: v1(26.42,49.94) 26.92,49.94 27.31,49.55 FPC1.4 ; 58.17,44.39 58.17,44.36 58.43,44.09 59.22,44.09 U10.7 ; C79.1 58.57,45.13 58.17,44.72 58.17,44.39
  Top Layer w0.5: 56.77,47.14 56.77,45.63 v1(56.75,45.62) 58.32,45.62 C79.1 ; 65.72,35.63 65.72,36.15 v1(65.15,36.73) ; 65.72,35.63 65.72,34.95 ; 65.72,35.63 65.73,35.62 v1(66.43,35.62) ; R11.2 69.47,4.52 H1.1 ; 59.41,42.44 C78.1 v1(59.41,41.05) ; v1(20.83,12.85) 20.88,12.91 v1(20.88,13.61) v1(20.88,14.3) C107.1 20.71,15.27 C108.1 19,14.56 17.79,14.56 ; v1(67.44,40.54) R34.1 ; v1(5.33,16.53) R70.1 ; v1(7.87,29.36) 7.85,29.39 C102.1 5.82,29.39 5.52,29.68
  PWR w0.5: v1(45.59,19.33) 45.88,19.62 45.88,21.07 46.23,21.42 46.23,23.27 45.59,23.9 40.24,23.9 39.08,22.74 38.37,22.74 ; 38.37,22.74 38.73,22.38 v1(38.73,21.36) ; 38.37,22.74 35.44,22.74 35.24,22.94 34.74,22.94 34.54,22.74 33.67,22.74 33.4,23.01 33.4,25.3 v1(30.67,28.03) ; 64.77,31.39 64.77,29.58 64.68,29.48 64.68,28.99 64.77,28.89 64.77,23.27 67.02,21.01 67.02,8.69 H1.1 ; 19.52,28.13 9.1,28.13 v1(7.87,29.36) 7.62,29.11 7.62,17.93 6.22,16.53 v1(5.33,16.53) ; v1(58.17,52.35) 59.94,52.35 61.47,50.82 61.47,46.51 60.58,45.62 v1(56.75,45.62) ; 50.8,39.65 49.78,40.66 H4.3 48.45,45.18 46.75,45.18 46.04,45.88 46.04,47.58 43.31,50.32 v1(39.24,50.32) 38.73,50.82 27.3,50.82 v1(26.42,49.94)
  Bottom Layer w0.157: v1(39.62,33.55) 39.62,34.09 C59.1 ; v1(38.73,21.36) 38.84,21.26 C61.1 ; v1(37.38,32.08) 37.38,33.79 37.21,33.96
  Bottom Layer w0.5: v1(45.59,19.33) 44.84,19.33 44.51,19.66 44.35,19.66 C29.1 43.94,20.06 43.94,21.58 44.07,21.71 44.12,21.71 44.33,21.92 44.34,21.92 v1(44.46,22.04) ; C101.1 C100.1 26.32,50.04 v1(26.42,49.94) ; R73.1 57.8,51.98 v1(58.17,52.35) 58.54,51.97 58.81,51.97 ; v1(28.95,28.06) 29.73,28.06 29.94,27.85 ; D1.1 72.08,3.64 H1.1 ; v1(56.52,32.16) 56.54,32.13 C93.1 C92.1 C91.1 60.86,32.13 v1(61.59,31.39) ; v1(56.75,45.62) R46.1 R45.1 56.67,42.4 v1(56.67,41.3) ; R72.1 20.01,9.86 v1(20.32,9.55) ; v1(46.86,30.99) 47.07,30.99 C58.1 47.47,31.17 v1(47.75,30.89) ; 29.95,27.84 30.48,27.84 v1(30.67,28.03) ; R64.1 39.95,50.32 v1(39.24,50.32) ; L13.1 33.35,7.77 v1(32.89,7.77)
  vias: v1(29.25,35.24) v1(29.98,35.15) v1(29.92,34.52) v1(30.57,34.59) v1(35.69,4.72) v1(35.81,6.12) v1(36.32,5.36) v1(36.45,4.6) v1(36.58,6.5) v1(36.83,5.87) v1(37.21,5.23) v1(37.46,4.6) v1(37.72,6.12) v1(37.85,5.49) v1(38.35,6.37) v1(38.35,4.98) v1(38.73,5.74) v1(39.12,4.85) v1(65.53,36.09)
3V3_A: length 16.6
  Top Layer w0.5: v1(70.36,16.15) 70.36,15.03 U8.6 70.23,11.97 C111.1 69.91,10.19 L10.2 ; R31.2 v1(76.71,18.82)
  PWR w0.5: v1(70.36,16.15) 70.36,18.06 71.12,18.82 v1(76.71,18.82)
+5V: length 131.7
  Top Layer w0.5: R52.2 55.24,1.99 C80.1 54.28,3.23 54.23,3.27
  PWR w1: v1(45.07,8.93) 45.07,7.25 41.78,3.96 38.04,3.96 37.82,3.75 35.46,3.75 35.24,3.96 15.88,3.96 10.86,8.98 10.86,11.27 8.76,13.36 5.91,13.36 4.06,15.2 4.06,24.98 5.04,25.96 5.04,26.67 4.06,27.65 4.06,31.5 v1(5.74,33.17) ; v1(27.33,42.54) 21.95,42.54 v1(19.18,39.78) ; 47.24,43.97 46.97,44.24 40.15,44.24 38.45,42.54 27.33,42.54
  Bottom Layer w1: v1(19.18,39.78) 19.18,36.09 21.5,33.77 arc(21.68,33.64) 21.81,33.46 22.48,32.79 22.48,31.65 21.08,30.25 6.48,30.25 5.74,30.99 v1(5.74,33.17)
  vias: v1(49.66,8.86) v1(49.65,8.13) v1(49.65,7.21) v1(49.68,6.52) v1(52.9,8.64) v1(53.69,8.51) v1(53.85,2.69) v1(54.47,2.69) v1(54.55,8.41) v1(55.08,2.69) v1(55.8,8.39) v1(55.91,2.69) v1(56.1,17.78) v1(56.39,3.2) v1(56.78,17.85) v1(57.54,17.73)
AGND: length 81.8
  Top Layer w0.157: 72.59,23.32 77.4,23.32 78.31,24.23 R30.1 ; 72.59,23.32 71.89,24.02 58.55,24.02 57.54,23.01 57.54,21.87 56.67,21.01 47.28,21.01 47.08,20.82 v1(46.48,20.82) ; 72.59,23.32 C69.1 ; v1(45.34,22.63) 45.36,22.65 46.04,22.65 U1.37 46.57,22.67 47.36,21.88 55.76,21.88 56.52,22.63 56.52,23.39 57.92,24.8 72.37,24.8 72.57,24.59 75.72,24.59 75.95,24.82 75.95,27.2 76.71,27.96 80.52,27.96 81.03,28.47 81.03,29.23 81.28,29.49 C65.2
  Bottom Layer w0.157: v1(46.48,20.82) 46.48,21.74 46.25,21.97 C25.1 v1(45.34,22.63)
  vias: v1(68.45,12.98) v1(68.96,22.88) v1(76.2,22.29) v1(76.2,16.79) v1(81.92,24.03) v1(82.61,18.95)
AVDD3V3_ETH: length 2
  Top Layer w0.157: U1.101 33.54,30.72 33.44,30.62 v1(33,30.62)
  Bottom Layer w0.5: v1(33,30.62) 32.73,30.89 L6.2
GND: length 271.6
  Top Layer w0.14: U12.G5 58.93,30.87 58.93,30.36 59.31,29.98 59.31,29.74 ; U12.N5 U12.P6
  Top Layer w0.157: FPC3.9 10.55,25.79 12.95,23.39 31.12,23.39 v1(31.21,23.48) ; U12.A6 57.91,28.39 v1(57.91,27.84) ; 5.34,24.27 10.3,24.27 12.33,22.24 v1(31.75,22.24) ; v1(31.37,20.85) 11.3,20.85 9.36,22.79 FPC3.15 ; 56.9,32.9 57.4,32.4 U12.J5 58.76,32.04 58.76,31.75 U12.G5 ; FPC3.18 8.7,21.29 10.29,19.71 32.26,19.71 33.27,20.73 v1(33.78,20.73) ; 59.31,29.74 58.96,29.4 U12.C4
  Top Layer w0.17: C52.2 46.36,38 45.21,36.85 v1(45.21,34.7) ; C52.2 45.61,37.91 44.53,37.91 ; C52.2 46.38,38.63 46.74,38.63 46.86,38.76 46.86,40.28 46.36,40.79 41.02,40.79 40.64,40.41 40.64,38.73 C50.2 41.46,38.73 42.33,39.61 ; 40.64,38.73 40.64,36.61 41.54,35.71 43.17,35.71 ; 41.97,19.76 41.97,19.73 42.48,19.22 42.97,19.22 44.07,18.12 44.07,14.76 43.56,14.25 42.42,14.25 42.32,14.35 C55.2 41.25,14.88 41.25,14.35 41.02,14.12 40.04,14.12 39.87,14.29 39.87,18.5 40.28,18.9 v2(40.64,18.9)
  Top Layer w0.2: U1.129 43.05,29.74 44.45,29.74 44.52,29.67 U1.57 ; U12.N2 v1(60.58,34.4) ; U12.H10 56.02,31.77 56.06,31.77 56.28,31.55 56.28,31.52 56.45,31.35 v1(56.45,31.07) 56.72,31.07 57.02,30.77 57.06,30.77 57.28,30.55 57.28,30.52 U12.E7 ; v1(58.93,29.87) 58.93,29.43 U12.C4 ; U12.P4 58.78,35.02 58.78,35.05 58.56,35.27 58.24,35.27 58.23,35.26 v1(57.91,35.26)
  Top Layer w0.5: J1.7 14.64,39.78 J1.8 16.48,37.94 C113.2 ; FPC3.22 0.64,33.75 0.64,38 1.5,38.87 J1.11 ; 30.59,24.31 28.57,24.31 28.29,24.03 ; J1.10 0.82,48.34 0.82,50.12 0.89,50.18 v1(0.89,53.11)
  Bottom Layer w0.157: v1(18.29,47.98) 18.85,48.54 21.08,48.54 21.72,47.9 22.99,47.9 23.88,47.01 23.88,37.78 24.55,37.11 27.94,37.11 28.58,36.47 28.58,34.57 28.83,34.31 29.34,34.31 30.23,33.43 30.23,31.6 30.04,31.41 30.04,30.83 30.03,30.82 30.03,29.96 29.86,29.78 28.41,29.78 v1(27.94,30.25) ; v1(18.41,44.47) 18.67,44.22 v1(21.46,44.22) 21.34,44.09 21.34,36.09 22.99,34.44 25.65,34.44 25.91,34.19 25.91,32.92 26.8,32.03 27.43,32.03 27.88,31.59 v1(27.88,31.14) ; v1(18.29,46.76) 18.67,46.38 22.1,46.38 22.73,45.74 22.73,36.85 23.87,35.72 26.67,35.72 27.18,35.2 27.18,33.68 27.75,33.11 28.64,33.11 28.96,32.79 28.96,31.14 v1(28.45,30.63)
  vias: v1(25.12,43.72) v1(31.02,37.32) v1(31,30.1) v1(31.36,10.98) v1(33.62,33.94) v1(37.4,19.92) v1(37.43,11.78) v1(38.46,29.02) v1(38.77,26.7) v1(38.71,25.77) v1(38.93,27.59) v1(39.14,25.09) v1(39.21,28.86) v1(39.27,12.08) v1(39.85,22.59) v1(39.92,29.26) v1(39.98,27.13) v1(39.95,25.92) v1(40.01,24.93) v1(40.14,28.09) v1(40.72,28.95) v1(40.91,25.86) v1(41.03,26.94) v1(41.09,24.87) v1(41.22,27.9) v1(42.08,28.83) v1(42.02,19.81) v1(42.11,27.69) v1(43.17,35.71) v1(43.61,14.05) v1(45.12,5.7) v1(45.97,11.71) v1(45.92,2.82) v1(46.37,32.83) v1(48.01,16.53) v1(51.81,13.23) v1(52.28,20.49) v1(53.09,31.77) v1(54.52,20.49) v1(58.67,21.91) v1(61.85,32.92) v1(70.27,26.76) v1(71.07,30.22) v1(82.21,15.78) v1(82.24,12.75) v1(82.23,6.42) v1(82.44,21.94)
VBAT: length 1.5
  Bottom Layer w0.5: 77.75,1.66 76.37,1.66 D1.2
VCC1V8_CODEC: length 9.8
  Top Layer w0.2: U1.31 45.08,21.07 45.08,21.08 45.08,21.36
  Top Layer w0.3: 45.08,21.36 45.08,22.17 44.84,22.42 44.84,23.01 v1(44.7,23.14)
  Bottom Layer w0.5: v1(44.7,23.14) 45,23.14 45.09,23.23 46.3,23.23 47.32,22.21 C23.1 47.32,18.6 L2.2
VCC1V8_IO7: length 2.9
  Top Layer w0.157: v1(35.18,21.36) 34.8,21.36 34.6,21.16 34.6,20.66 U1.1
  Bottom Layer w0.157: C64.1 35.05,21.49 v1(35.18,21.36)
  Bottom Layer w0.3: C64.1 34.67,21.51 34.67,21.95 34.49,22.13 34.49,22.25 R7.2
VCC1V8_MICBIAS: length 45.9
  Top Layer w0.2: v1(65.66,23.52) 63.55,21.41 57.57,21.41 56.19,20.04 45.67,20.04 45.43,20.28 45.43,20.64
  Top Layer w0.5: R28.1 81.99,31.45 v1(81.92,31.52)
  PWR w0.5: v1(81.92,31.52) 80.26,31.52 79.25,30.5 79.25,25.3 77.47,23.52 v1(65.66,23.52)
VCC1V8_USB: length 4.3
  Top Layer w0.2: U1.24 42.63,21.22 v1(42.66,21.25)
  Bottom Layer w0.5: C28.1 41.7,19.13 R4.2 43.05,20.85 v1(42.66,21.25)
VCC3V3_RTC: length 52.9
  Top Layer w0.2: v1(39.54,21.5) 40.46,21.5 40.88,21.07 U1.19
  PWR w0.5: v1(41.27,21.87) 41.27,21.61 43.94,18.95 45.12,18.95 45.34,18.73 47.15,18.73 48.26,19.84 50.2,19.84 50.3,19.93 50.8,19.93 50.89,19.84 63.75,19.84 65.28,18.31 v1(65.28,17.55)
  Bottom Layer w0.5: v1(41.27,21.87) 41.02,22.12 C56.1 40.26,21.9 40.26,21.49 40.05,21.28 39.75,21.28 39.58,21.45 ; R17.1 68.25,1.88 66.42,3.71 66.42,4.89 66.47,4.94 66.47,6.79 66.42,6.83 66.42,11.96 65.28,13.11 v1(65.28,17.55)
VCC_FLASH: length 82.9
  Top Layer w0.14: 59.4,34.81 59.31,34.81 U12.N4 U12.P5
  Top Layer w0.157: U12.N4 U12.M4
  Top Layer w0.2: U12.P3 59.44,34.93 59.44,35.58 ; v1(57.43,29.4) 57.89,29.4 57.9,29.41 ; U1.43 48.28,24.77 v1(48.51,24.54)
  Top Layer w0.5: v1(52.77,35.73) 52.9,35.86 59.18,35.86 59.43,35.61 ; v1(66.42,14.18) C85.1 65.31,14.34 C84.1 63.62,14.6 62.03,14.6 62.03,13.49 R55.1 ; v1(61.47,35.71) 59.56,35.71 59.44,35.58
  PWR w0.5: 52.74,35.77 53.72,34.79 53.72,30.69 55.06,29.35 57.25,29.35 ; 57.44,29.48 58.2,28.72 61.48,28.72 63.71,26.5 63.71,25.21 ; 63.71,25.21 63.71,23.18 66.42,20.47 v1(66.42,14.18) ; 63.71,25.21 63.7,25.23 v1(60.07,25.23) 58.73,23.89 v1(58.73,23.18) 58.77,23.18 59.7,22.25 59.7,21.8 58.99,21.09 50.12,21.09 v1(49.58,20.55)
  Bottom Layer w0.157: v1(58.73,23.18) 58.49,22.94 R54.1
  Bottom Layer w0.5: 55.33,32.1 55.33,33.82 54.69,34.46 52.81,34.46 52.79,34.48 ; v1(48.51,24.54) C60.1 49.05,21.08 v1(49.58,20.55) ; R57.2 59.11,26.19 v1(60.07,25.23) ; v1(52.77,35.73) 52.81,35.69 52.81,34.48
  vias: v1(62.1,35.71) v1(62.77,35.71) v1(63.54,35.71)
ADCIN0: length 61.3
  Top Layer w0.157: v1(51.56,7.77) 51.56,9.8 50.93,10.44 45.59,10.44 44.45,11.58 44.45,18.2 42.58,20.07 42.44,20.07 42.3,20.21 42.3,20.62 U1.23 ; 69.34,32.99 69.21,33.12 67.47,33.12 67.64,32.95 R43.1 v1(65.28,29.23)
  Bottom Layer w0.157: v1(65.28,29.23) 64.26,28.22 64.26,13.74 63.12,12.6 57.91,12.6 56.9,11.58 56.9,8.03 56.64,7.77 v1(51.56,7.77)
EMMC_CLK/FSPI_CLK: length 43.6
  Top Layer w0.157: 59.49,14.6 59.44,14.65 v1(59.44,15.52) ; U12.M6 57.9,33.69 57.76,33.54 v1(52.06,33.54) 50.8,32.28 50.8,27.08 50.42,26.69 R23.2
  Bottom Layer w0.157: v1(59.44,15.52) 61.9,17.98 61.9,25.5 59.59,27.81 59.59,29.84 59.08,30.35 52.35,30.35 52.04,30.67 52.04,33.52 v1(52.06,33.54)
EMMC_CMD/FSPI_CS: length 38
  Top Layer w0.157: U12.M5 58.4,33.82 57.86,33.28 52.82,33.28 v1(52.47,32.93) 51.56,32.03 51.56,26.98 50.75,26.17 U1.47 ; v1(62.48,23.52) 62.03,23.06 U11.1
  Bottom Layer w0.157: v1(62.48,23.52) 62.48,25.3 60.07,27.71 60.07,30 59.44,30.63 53.09,30.63 52.47,31.25 v1(52.47,32.93) 52.87,33.34 R58.1
EMMC_D0/FSPI_D0: length 34.2
  Top Layer w0.157: v1(58.29,16.28) 58.29,14.67 58.22,14.6 ; U12.A3 59.4,26.8 58.79,26.19 56.14,26.19 v1(56.08,26.14) 53.47,23.52 47.85,23.52 47.3,24.07 U1.41
  Bottom Layer w0.157: v1(58.29,16.28) 59.31,16.28 61.47,18.44 61.47,21.23 60.33,22.38 60.33,24.15 59.94,24.54 58.17,24.54 57.61,25.1 R57.1 57.56,26.14 v1(56.08,26.14)
EMMC_D1/FSPI_D1: length 24
  Top Layer w0.157: U11.2 60.81,22.45 v1(60.81,23.19) ; U1.42 47.61,24.42 48.01,24.03 52.58,24.03 55.24,26.69 v1(55.72,26.69) 58.42,26.69 58.9,27.17 U12.A4
  Bottom Layer w0.157: v1(60.81,23.19) 60.81,25.2 59.31,26.69 v1(55.72,26.69)
EMMC_D2/FSPI_D2: length 24.2
  Top Layer w0.157: v1(61.47,23.27) 61.11,23.62 59.79,23.62 v1(59.49,23.32) U11.3 ; U1.44 52.4,25.12 54.48,27.2 v1(58.14,27.2) 58.42,27.49 58.42,28.38 U12.A5
  Bottom Layer w0.157: R54.2 59.49,22.76 v1(59.49,23.32) ; v1(61.47,23.27) 61.47,25.17 59.44,27.2 v1(58.14,27.2)
EMMC_D3/FSPI_D3: length 35.3
  Top Layer w0.157: R55.2 60.9,14.45 60.76,14.6 60.83,14.67 v1(60.83,15.77) ; 60.25,28.54 59.9,28.9 ; 60.26,28.54 60.58,28.22 v1(60.58,27.86) 60.58,26.99 59.14,25.55 57.15,25.55 54.36,22.76 47.62,22.76 47.01,23.37 U1.39
  Bottom Layer w0.157: v1(60.58,27.86) 62.99,25.45 62.99,17.93 v1(60.83,15.77)
EMMC_D4: length 17.9
  Top Layer w0.14: U12.B3 59.4,28.89 59.82,28.47
  Top Layer w0.157: U1.40 47.15,23.72 47.73,23.14 53.85,23.14 56.64,25.93 59.03,25.93 59.94,26.85 59.94,28.35 59.82,28.47
EMMC_D5: length 23.2
  Top Layer w0.14: 59.4,29.4 59.4,29.39 U12.B4
  Top Layer w0.157: U1.38 46.86,23.02 47.51,22.38 54.61,22.38 57.4,25.17 59.26,25.17 61.47,27.38 61.47,29.62 61.1,29.98 59.98,29.98 59.4,29.4 59.4,29.4
EMMC_D6: length 15.5
  Top Layer w0.157: v1(53.32,27.56) 53.32,27.02 51.77,25.47 U1.45 ; v1(58.29,29.92) 58.4,29.81 U12.B5
  Bottom Layer w0.157: v1(58.29,29.92) 55.68,29.92 v1(53.32,27.56)
EMMC_D7: length 13.7
  Top Layer w0.157: U1.46 51.32,25.82 52.19,26.69 52.19,27.33 52.91,28.04 57.1,28.04 57.28,28.22 57.28,28.6 57.58,28.9 U12.B6
ETH_RN: length 25.7
  Top Layer w0.158: U1.97 33.94,32.12 29.34,32.12 29.17,32.29 v1(27.92,32.29)
  Bottom Layer w0.158: R36.2 20.63,44.91 20.83,45.11 21.46,45.11 21.99,44.58 21.99,39 arc(21.95,38.91) 21.86,38.87 arc(21.76,38.82) 21.72,38.73 21.72,38.5 arc(21.76,38.41) 21.86,38.37 arc(21.95,38.32) 21.99,38.23 21.99,37.52 arc(21.95,37.42) 21.86,37.38 arc(21.76,37.34) 21.72,37.24 21.72,37.02 arc(21.76,36.92) 21.86,36.88 arc(21.95,36.84) 21.99,36.74 21.99,36.2 23.09,35.1 24.33,35.1 arc(24.43,35.06) 24.47,34.96 arc(24.51,34.86) 24.61,34.82 24.83,34.82 arc(24.93,34.86) 24.97,34.96 arc(25.01,35.06) 25.11,35.1 25.68,35.1 26.36,34.42 26.36,32.92 26.86,32.42 27.8,32.42 v1(27.92,32.29)
ETH_RP: length 25.7
  Top Layer w0.158: v1(28.43,31.59) 29.17,31.59 29.34,31.77 33.94,31.77 U1.98
  Bottom Layer w0.158: v1(28.43,31.59) 28.43,32.43 28.13,32.73 26.99,32.73 26.67,33.04 26.67,34.61 25.83,35.46 23.24,35.46 22.35,36.35 22.35,44.73 21.61,45.47 20.83,45.47 20.58,45.71 20.58,45.83
ETH_TN: length 30.8
  Top Layer w0.158: U1.99 31.09,31.42 30.02,30.35 29.82,30.35 29.37,30.8 v1(29.32,30.8)
  Bottom Layer w0.158: v1(29.32,30.8) 29.46,30.95 29.46,33.17 29.12,33.52 28.3,33.52 27.81,34 27.81,34.61 arc(27.76,34.74) 27.62,34.8 arc(27.49,34.85) 27.44,34.98 27.44,35.11 arc(27.49,35.24) 27.62,35.3 arc(27.76,35.35) 27.81,35.48 27.81,35.91 27.37,36.35 25.47,36.35 arc(25.34,36.29) 25.29,36.16 arc(25.23,36.03) 25.1,35.98 24.97,35.98 arc(24.84,36.03) 24.79,36.16 arc(24.73,36.29) 24.6,36.35 24.26,36.35 23.24,37.36 23.24,37.81 arc(23.2,37.9) 23.12,37.94 arc(23.03,37.97) 22.99,38.06 22.99,38.31 arc(23.03,38.4) 23.12,38.44 arc(23.2,38.47) 23.24,38.56 23.24,39.3 arc(23.2,39.39) 23.12,39.43 arc(23.03,39.47) 22.99,39.55 22.99,39.8 arc(23.03,39.89) 23.12,39.93 arc(23.2,39.97) 23.24,40.05 23.24,41.03 arc(23.2,41.12) 23.12,41.15 arc(23.03,41.19) 22.99,41.28 22.99,41.53 arc(23.03,41.62) 23.12,41.65 arc(23.2,41.69) 23.24,41.78 23.24,42.69 arc(23.2,42.78) 23.12,42.82 arc(23.03,42.85) 22.99,42.94 22.99,43.19 arc(23.03,43.28) 23.12,43.32 arc(23.2,43.35) 23.24,43.44 23.24,46.38 22.48,47.14 20.83,47.14 20.58,46.9 20.58,46.9
ETH_TP: length 30.9
  Top Layer w0.158: U1.100 33.93,31.09 31.27,31.09 30.22,30.04 29.57,30.04 29.4,30.21 v1(29.06,30.21)
  Bottom Layer w0.158: 20.58,47.84 20.58,47.64 20.72,47.5 22.63,47.5 23.55,46.58 23.55,37.49 24.39,36.66 27.5,36.66 28.17,35.99 28.17,34.08 28.42,33.83 29.24,33.83 29.77,33.3 29.77,30.4 29.59,30.21 v1(29.06,30.21)
G0A3_TP_INT: length 40.2
  Top Layer w0.157: U1.62 48.16,31.42 49.02,32.28 49.02,36.6 49.78,37.36 61.59,37.36 62.48,38.25 62.48,42.36 62.46,42.38 62.46,44.69 62.48,44.72 62.48,46.16 61.06,47.58 60.39,47.58 59.31,48.67 59.31,49.81 58.8,50.32 58.8,50.95 58.42,51.33 57.79,51.33 57.64,51.19 57.64,48.79 FPC2.3
G0A4_TP_RESET: length 36.6
  Top Layer w0.157: FPC2.6 56.13,48.76 v1(56.13,47.52) ; U1.63 47.75,31.77 48.64,32.66 48.64,36.76 49.75,37.87 61.47,37.87 62.1,38.51 62.1,46 60.9,47.2 59.82,47.2 v1(59.47,47.55)
  Bottom Layer w0.157: v1(59.47,47.55) 59.44,47.52 v1(56.13,47.52)
G0A5_I2C1_SCL: length 35.1
  Top Layer w0.157: U1.64 47.21,32.12 48.26,33.18 48.26,36.99 49.66,38.38 61.34,38.38 61.72,38.76 61.72,45.84 60.74,46.82 59.38,46.82 58.67,47.52 58.67,48.76 FPC2.1
  Top Layer w0.17: FPC2.1 58.67,48.8 v1(58.67,49.68)
  Bottom Layer w0.17: v1(58.67,49.68) 58.81,49.81 R74.2
G0A6_I2C1_SDA: length 34.9
  Top Layer w0.157: 45.43,32.75 45.43,33.52 45.72,33.81 47.01,33.81 47.01,33.81 47.12,33.81 47.88,34.57 47.88,37.24 49.48,38.84 61.06,38.84 61.21,38.99 61.21,45.72 60.55,46.38 59.05,46.38 58.17,47.27 58.17,48.76 FPC2.2
  Top Layer w0.17: FPC2.2 v1(58.15,50.44)
  Bottom Layer w0.17: v1(58.15,50.44) 57.62,50.97 57.62,51.12
G1A1_PWM4: length 19.5
  Top Layer w0.157: U1.73 42.63,34.4 v1(42.8,34.57)
  Bottom Layer w0.157: v1(42.8,34.57) 42.8,35.33 41.27,36.85 36.2,36.85 35.05,35.71 30.61,35.71 29.59,36.73 29.59,38.84 U13.4
G1A2_WL_EN: length 56.1
  Top Layer w0.157: 17.79,5.56 17.33,5.56 v1(17.14,5.74) 16.64,6.25 v1(16.64,11.71) ; U1.74 42.28,35.09 v1(42.3,35.12)
  Bottom Layer w0.157: v1(17.14,5.74) 17.02,5.87 R68.1 ; v1(42.3,35.12) 42.3,35.1 42.02,34.81 40.85,34.81 40.26,35.41 40.26,35.56 40.1,35.71 36.96,35.71 36.45,35.2 36.45,33.55 35.69,32.79 34.95,32.79 34.8,32.63 34.8,27.59 33.05,25.85 33.05,22.56 32.64,22.15 32.64,21.51 29.72,18.59 29.72,12.34 29.08,11.71 v1(16.64,11.71)
G1A3_TX1: length 68.5
  Top Layer w0.157: v1(41.62,35.25) 41.62,34.73 41.95,34.4 41.95,32.77 41.93,32.75 ; U14.43 6.67,6.37 8.76,6.37 9.65,7.26 v1(9.65,9.68)
  Bottom Layer w0.157: v1(41.62,35.25) 41.62,35.75 40.89,36.47 36.85,36.47 36.59,36.22 36.58,36.22 36.2,35.84 36.2,35.82 35.81,35.44 35.81,34.19 35.18,33.55 34.42,33.55 34.04,33.17 34.04,28.2 32.07,26.24 8.07,26.24 7.49,25.66 7.49,11.84 v1(9.65,9.68)
G1A4_RX1: length 65.6
  Top Layer w0.157: U14.42 8.48,7.36 9.02,7.9 v1(9.02,11.45) ; U1.76 41.6,32.77 41.6,34.38 41.03,34.95 41.03,35.45 41.02,35.46
  Bottom Layer w0.157: 41.02,35.46 41.02,35.59 40.51,36.09 36.83,36.09 36.19,35.45 36.19,33.93 35.43,33.17 34.57,33.17 34.42,33.02 34.42,27.96 32.43,25.98 8.18,25.98 7.75,25.55 7.75,12.72 v1(9.02,11.45)
  vias: v1(40.97,35.46)
G1B0_ETH_ACT: length 63.2
  Top Layer w0.157: 2.16,52.65 2.16,52.98 v1(2.54,53.36) ; v1(41.91,41.81) 41.5,41.81 40.38,40.68 40.38,34.96 41.23,34.1 41.23,32.71
  Bottom Layer w0.157: v1(41.91,41.81) 41.91,43.2 43.56,44.86 43.56,51.21 42.42,52.35 12.7,52.35 12.19,52.86 3.05,52.86 v1(2.54,53.36)
G1B1_ETH_SPD: length 60.2
  Top Layer w0.157: v1(4.83,52.35) 4.32,52.35 4.03,52.63 3.45,52.63 3.3,52.78 ; v1(40.87,42.04) 40.87,41.91 40.12,41.16 40.12,34.71 40.88,33.95 U1.78
  Bottom Layer w0.157: v1(4.83,52.35) 12.06,52.35 12.45,51.97 41.78,51.97 43.18,50.57 43.18,45.24 40.87,42.93 v1(40.87,42.04)
G1B2_TX2: length 44.5
  Top Layer w0.157: H4.6 53.72,46.38 54.1,46 54.1,41.05 54.86,40.28 59.94,40.28 60.45,40.79 60.45,42.7 60.11,43.04 U10.9 58.22,43.04 57.72,42.53 57.29,42.53 ; 40.53,32.75 40.51,32.77 40.51,33.67 39.86,34.32 39.86,41.92 40.51,42.57 43.56,42.57 v1(43.82,42.82)
  Bottom Layer w0.157: H4.6 51.05,45.11 51.05,43.08 50.29,42.32 44.32,42.32 v1(43.82,42.82)
G1B3_RX2: length 43.8
  Top Layer w0.157: 57.29,44.06 57.82,44.06 58.34,43.54 U10.8 60.12,43.54 60.71,42.95 60.71,40.54 59.88,39.71 53.4,39.71 52.32,40.79 H4.5 ; U1.80 40.16,32.77 40.16,33.65 39.5,34.31 39.5,42.06 40.52,43.08 42.93,43.08 v1(43.18,43.33)
  Bottom Layer w0.157: H4.5 52.32,42.82 51.56,42.06 43.56,42.06 43.18,42.44 v1(43.18,43.33)
G3B0: length 21
  Top Layer w0.157: v1(20.19,25.3) 20.19,32.16 H3.1 ; U1.117 31.49,25.12 v1(31.3,24.93)
  Bottom Layer w0.157: v1(31.3,24.93) 20.56,24.93 v1(20.19,25.3)
G3B1: length 24
  Top Layer w0.157: v1(17.78,24.66) H3.2 ; U1.118 33.93,24.75 33.52,24.75 33.45,24.68 v1(31.89,24.68)
  Bottom Layer w0.157: v1(31.89,24.68) 31.7,24.5 17.94,24.5 v1(17.78,24.66)
G3B2: length 27.5
  Top Layer w0.157: v1(14.99,24.15) 14.99,32.03 H3.3 ; U1.119 33.93,24.4 32.22,24.4 32.06,24.24 31.7,24.24 v1(31.52,24.07)
  Bottom Layer w0.157: v1(14.99,24.15) 15.23,23.91 31.37,23.91 v1(31.52,24.07)
G3B3: length 30
  Top Layer w0.157: v1(31.94,23.58) 32.43,24.07 U1.120 ; H3.4 12.7,24.79 v1(13.33,24.15)
  Bottom Layer w0.157: v1(31.94,23.58) 31.25,22.88 14.61,22.88 v1(13.33,24.15)
G3B4: length 33.9
  Top Layer w0.157: H3.5 12.06,30.38 v1(12.06,25.04) ; v1(32.62,23.47) 33.29,23.47 33.52,23.7 33.93,23.7 U1.121
  Bottom Layer w0.157: v1(32.62,23.47) 32.62,22.5 31.74,21.61 13.59,21.61 12.06,23.14 v1(12.06,25.04)
G3C6_WL_WAKE_HOST: length 24.1
  Top Layer w0.157: U1.4 35.63,19.81 v1(35.61,19.79)
  Bottom Layer w0.157: v1(35.61,19.79) 35.61,18.95 30.48,13.82 30.48,9.42 27.69,6.63 23.29,6.63 R71.2 23.24,5.87 23.11,5.74 21.73,5.74 Q1.2
G3D3: length 17.3
  Top Layer w0.157: R27.1 30.35,18.69 v1(30.86,18.19) ; U1.9 37.36,20.66 37.36,21.21 37.08,21.49 35.84,21.49 v1(34.99,22.34)
  Bottom Layer w0.17: v1(30.86,18.19) 30.86,19.2 32.9,21.24 32.9,22.04 33.32,22.45 33.32,24.07 34.04,24.79 34.92,24.79 35.43,24.28 35.43,22.78 v1(34.99,22.34)
LINE_OUT: length 24
  Top Layer w0.157: U1.29 44.38,20.03 44.65,19.76 56.31,19.76 57.68,21.13 64.87,21.13 65.89,20.12 C70.1
MIC0_N: length 8
  Top Layer w0.157: U7.2 80.14,19.63 80.14,20.22 79.17,21.18 R30.2 79.25,25.25 C66.2 79.22,26.19 C22.1
MIC0_P: length 17.3
  Top Layer w0.157: R29.1 81.9,28.38 MIC1.1 ; MIC1.1 81.78,27.18 C66.1 79.22,27.2 C21.1 ; MIC1.1 81.9,26.3 81.79,26.19 80.39,26.19 80.14,25.93 80.14,21.49 81.53,20.09 81.53,18.57 81.28,18.31 80.09,18.31 U7.1
MIPI_I2C3_SCL: length 43.8
  Top Layer w0.157: v1(5.6,19.3) 6.61,18.28 21.11,18.28 22.73,16.66 33.89,16.66 34.42,17.19 34.42,18.57 34.6,18.75 R65.1 35.21,18.9 35.21,19.17 35.36,19.33 35.76,19.33 36.33,19.9 36.33,20.64 ; v1(4.19,26.31) 5.46,26.31 FPC3.8
  Bottom Layer w0.157: v1(5.6,19.3) 5.6,24.91 v1(4.19,26.31)
MIPI_I2C3_SDA: length 47.4
  Top Layer w0.157: v1(5.1,18.8) 5.42,18.48 5.92,18.48 6.47,17.94 20.82,17.94 22.48,16.28 35.05,16.28 35.69,16.92 35.69,18.57 35.87,18.75 36.32,18.75 36.32,19.46 37.03,20.16 37.03,20.64 ; v1(3.3,26.82) 3.33,26.79 FPC3.7
  Bottom Layer w0.157: v1(5.1,18.8) 5.1,24.51 3.3,26.31 v1(3.3,26.82)
MIPI_MCLK0: length 29.5
  Top Layer w0.157: R26.2 32.59,17.88 32.26,17.55 23.11,17.55 21.59,19.07 9.91,19.07 8.19,20.79 FPC3.19
MIPI_RST: length 43.4
  Top Layer w0.157: U1.3 35.28,20.06 34.16,18.95 34.16,17.3 33.79,16.92 22.98,16.92 21.34,18.57 6.73,18.57 6.41,18.88 6.41,19.55 v1(6.22,19.75) ; FPC3.5 6.94,27.79 v1(6.98,27.84)
  Bottom Layer w0.157: v1(6.22,19.75) 6.22,27.07 v1(6.98,27.84)
